# Altium schematic sheet Breath LED,Temp,Touch key,Motor.SchDoc
size A4
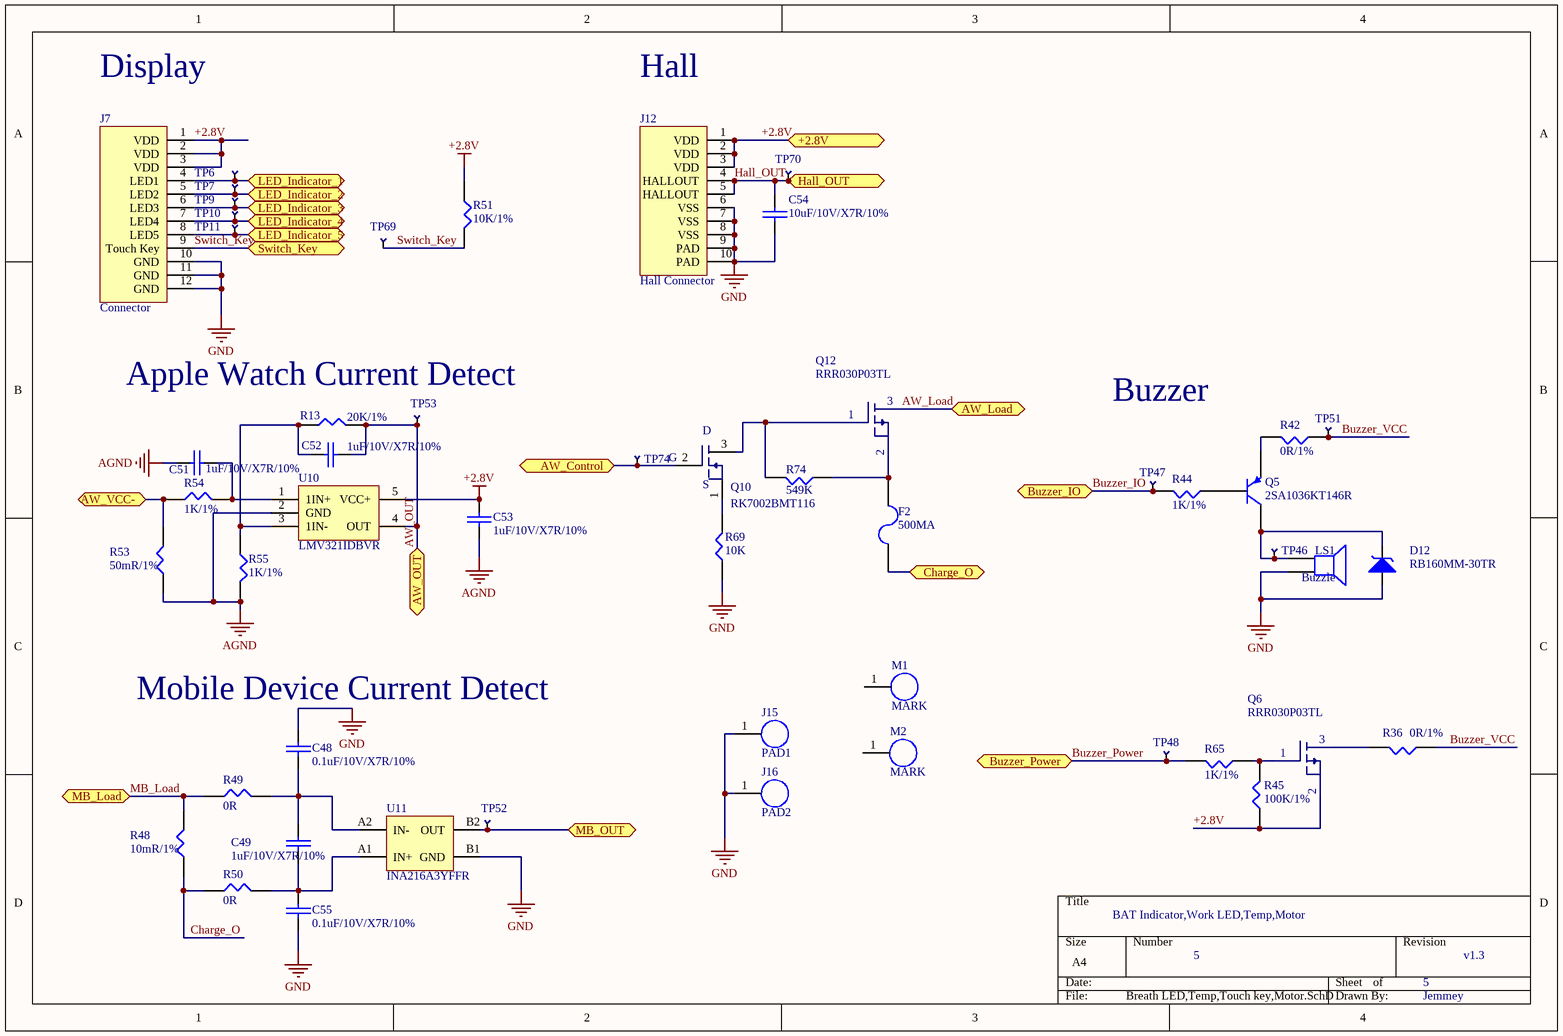
[diagram p0: Breath LED,Temp,Touch key,Motor.SchDoc]

## Parts
C48  0.1uF/10V/X7R/10%  [0402C]
C49  1uF/10V/X7R/10%  [0402C]
C51  1uF/10V/X7R/10%  [0402C]
C52  1uF/10V/X7R/10%  [0402C]
C53  1uF/10V/X7R/10%  [0402C]
C54  10uF/10V/X7R/10%  [0603C]
C55  0.1uF/10V/X7R/10%  [0402C]
D12  RB160MM-30TR  [DO-214AC]
F2  500MA  [1206-FUSE]
J7  Connector  [FPC_CON12-BACK-MOLEX]
J12  Hall Connector  [FPC_CON8-KYOCERA]
J15  PAD1  [PAD1]
J16  PAD2  [PAD2]
LS1  Buzzle  [Buzzer 7525]
M1  MARK  [Mark Point]
M2  MARK  [Mark Point]
Q5  2SA1036KT146R  [SMT3]
Q6  RRR030P03TL  [TSMT3]
Q10  RK7002BMT116  [SOT23]
Q12  RRR030P03TL  [TSMT3]
R13  20K/1%  [0402R]
R36  0R/1%  [0603R]
R42  0R/1%  [0402R]
R44  1K/1%  [0402R]
R45  100K/1%  [0402R]
R48  10mR/1%  [0805]
R49  0R  [0603R]
R50  0R  [0603R]
R51  10K/1%  [0402R]
R53  50mR/1%  [0805]
R54  1K/1%  [0402R]
R55  1K/1%  [0402R]
R65  1K/1%  [0402R]
R69  10K  [0402R]
R74  549K  [0402R]
TP6  TEST  [Test Pad]  (value not drawn)
TP7  TEST  [Test Pad]  (value not drawn)
TP9  TEST  [Test Pad]  (value not drawn)
TP10  TEST  [Test Pad]  (value not drawn)
TP11  TEST  [Test Pad]  (value not drawn)
TP46  TEST  [Test Pad]  (value not drawn)
TP47  TEST  [Test Pad]  (value not drawn)
TP48  TEST  [Test Pad]  (value not drawn)
TP51  TEST  [Test Pad]  (value not drawn)
TP52  TEST  [Test Pad]  (value not drawn)
TP53  TEST  [Test Pad]  (value not drawn)
TP69  TEST  [Test Pad]  (value not drawn)
TP70  TEST  [Test Pad]  (value not drawn)
TP74  TEST  [Test Pad]  (value not drawn)
U10  LMV321IDBVR  [SOT23-5]
U11  INA216A3YFFR  [YFF]

## Ports
+2.8V, AW_Control, AW_Load, AW_OUT (bidir), AW_VCC- (bidir), Buzzer_IO, Buzzer_Power, Charge_O, Hall_OUT, LED_Indicator_1, LED_Indicator_2, LED_Indicator_3, LED_Indicator_4, LED_Indicator_5, MB_Load (bidir), MB_OUT (bidir), Switch_Key

## Nets
+2.8V: C53.2 J7.1(VDD) J7.2(VDD) J7.3(VDD) J12.1(VDD) J12.2(VDD) J12.3(VDD) Q6.2(S) R45.1 R51.1 U10.5(VCC+) ; port +2.8V
AGND: C51.1 C53.1 R53.1 R55.2 U10.2(GND)
GND: C48.1 C54.2 C55.2 D12.2(A) J7.10(GND) J7.11(GND) J7.12(GND) J12.6(VSS) J12.7(VSS) J12.8(VSS) J12.9(PAD) J12.10(PAD) J15.1 J16.1 LS1.2 R69.1 U11.B1(GND)
AW_Control: Q10.2(G) TP74.1 ; port AW_Control
AW_Load: Q12.3(D) ; port AW_Load
AW_OUT: C52.2 R13.2 TP53.1 U10.4(OUT) ; port AW_OUT
AW_VCC-: R53.2 R54.1 ; port AW_VCC-
Buzzer_IO: R44.2 TP47.1 ; port Buzzer_IO
Buzzer_Power: R65.2 TP48.1 ; port Buzzer_Power
Buzzer_VCC: R36.1 R42.1 TP51.1
Charge_O: R48.1 R50.1
Charge_O: F2.2 ; port Charge_O  [a separate net that carries the same name]
Hall_OUT: C54.1 J12.4(HALLOUT) J12.5(HALLOUT) TP70.1 ; port Hall_OUT
LED_Indicator_1: J7.4(LED1) TP6.1 ; port LED_Indicator_1
LED_Indicator_2: J7.5(LED2) TP7.1 ; port LED_Indicator_2
LED_Indicator_3: J7.6(LED3) TP9.1 ; port LED_Indicator_3
LED_Indicator_4: J7.7(LED4) TP10.1 ; port LED_Indicator_4
LED_Indicator_5: J7.8(LED5) TP11.1 ; port LED_Indicator_5
MB_Load: R48.2 R49.1 ; port MB_Load
MB_OUT: TP52.1 U11.B2(OUT) ; port MB_OUT
Switch_Key: J7.9(Touch_Key) R51.2 TP69.1 ; port Switch_Key
NetC48_2: C48.2 C49.1 R49.2 U11.A2(IN-)
NetC49_2: C49.2 C55.1 R50.2 U11.A1(IN+)
NetC51_2: C51.2 R54.2 U10.1(1IN+)
NetC52_1: C52.1 R13.1 R55.1 U10.3(1IN-)
NetD12_1: D12.1(K) LS1.1 Q5.1(E) TP46.1
NetF2_1: F2.1 Q12.2(S) R74.1
NetQ5_2: Q5.2(B) R44.1
NetQ5_3: Q5.3(C) R42.2
NetQ6_1: Q6.1(G) R45.2 R65.1
NetQ6_3: Q6.3(D) R36.2
NetQ10_1: Q10.1(S) R69.2
NetQ10_3: Q10.3(D) Q12.1(G) R74.2

Not connected (* = marked no-connect by the designer): M1 1; M2 1

## Notes on the sheet
- Display
- Hall
- Apple Watch Current Detect
- Buzzer
- (near C48) Mobile Device Current Detect
- BAT Indicator,Work LED,Temp,Motor
- 5
- v1.3
- Jemmey

## Library data of the parts
C48 C55 = CAP: 厂家：Murata，型号：GRM155R71A104KA01D
C49 C51-C53 = CAP: 厂家：Murata，型号：GRM155R61C105KA12D
C54 = CAP: 厂家：Murata，型号：GRM188R61A106KE69D
D12 = Schottky barri: 厂家：ROHM，型号：RB160MM-30TR
F2 = FUSE2: 厂家：万瑞和，型号：WH1206-050
J7 = Temp Con: 厂家：Molex，型号：5034801200_sd
J12 = Temp C: 厂家：京瓷，型号：046298008 000883+
J15 M1 M2 = PAD1: None
J16 = PAD2: None
LS1 = Speaker: 厂家：常州超音电子，型号：SMD-8503-3016-2.7K
Q5 = PNP: 厂家：ROHM，型号：2SA1036KT146R
Q6 Q12 = PMOS: 厂家：ROHM，型号：RRR030P03TL
Q10 = RK7002BMT116: 厂家：ROHM，型号：RK7002BMT116
R13 = RES1: 厂家：Yageo，型号：RC0402FR-0720KL
R36 R42 = RES1: 厂家：Yageo，型号：RC0402FR-070RL
R44 R65 = RES: 厂家：Yageo，型号：RC0402FR-071KL
R45 = RES: 厂家：Yageo，型号：RC0402FR-07100KL
R48 = RES1: 厂家：Yageo，型号：RL0805FR-070R01L
R49 R50 = RES1: 厂家：Yageo，型号：RC0603FR-070RL
R51 = RES1: 厂家：Yageo，型号：RC0402FR-0710KL
R53 = RES1: 厂家：Yageo，型号：RL0805FR-070R05L
R54 R55 = RES1: 厂家：Yageo，型号：RC0402FR-071KL
R69 R74 = RES1
TP6 TP7 TP9-TP11 TP46-TP48 TP51-TP53 TP69 TP70 = TEST: Test Point
U10 = LMV321IDBVR: 厂家：TI，型号：LMV321IDBVR
U11 = INA216A3YFFR: 厂家：TI，型号：INA216A3YFFR